# Altium schematic sheet SuperClock_LED.SchDoc
size A4; Organization: Altium Limited; Address1: L3, 12a Rodborough Rd; Address2: Frenchs Forest; Address3: NSW; Address4: Australia 2086
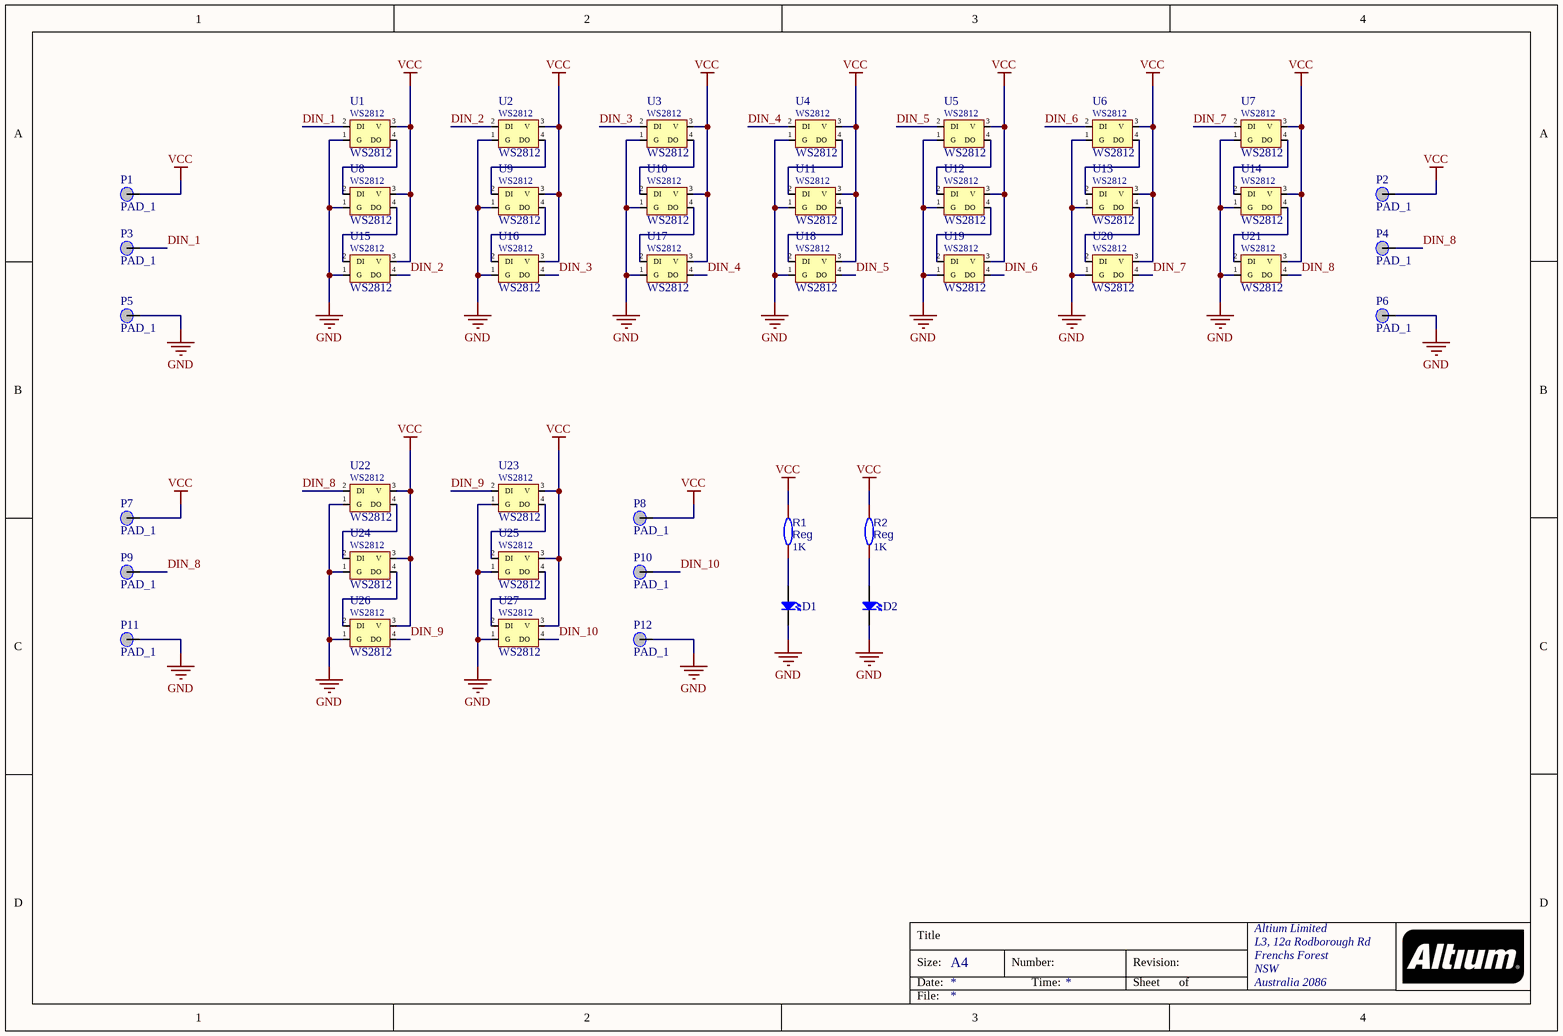
[diagram p0: SuperClock_LED.SchDoc]

## Parts
D1  LED  [LED0603]  (value not drawn)
D2  LED  [LED0603]  (value not drawn)
P1  PAD_1  [PAD_PIN_1_SMD_ARC]
P2  PAD_1  [PAD_PIN_1_SMD_ARC]
P3  PAD_1  [PAD_PIN_1_SMD_ARC]
P4  PAD_1  [PAD_PIN_1_SMD_ARC]
P5  PAD_1  [PAD_PIN_1_SMD_ARC]
P6  PAD_1  [PAD_PIN_1_SMD_ARC]
P7  PAD_1  [PAD_PIN_1_SMD_ARC]
P8  PAD_1  [PAD_PIN_1_SMD_ARC]
P9  PAD_1  [PAD_PIN_1_SMD_ARC]
P10  PAD_1  [PAD_PIN_1_SMD_ARC]
P11  PAD_1  [PAD_PIN_1_SMD_ARC]
P12  PAD_1  [PAD_PIN_1_SMD_ARC]
R1  Reg  value 1K  [R0603]
R2  Reg  value 1K  [R0603]
U1  WS2812  [WS2812B-2020]
U2  WS2812  [WS2812B-2020]
U3  WS2812  [WS2812B-2020]
U4  WS2812  [WS2812B-2020]
U5  WS2812  [WS2812B-2020]
U6  WS2812  [WS2812B-2020]
U7  WS2812  [WS2812B-2020]
U8  WS2812  [WS2812B-2020]
U9  WS2812  [WS2812B-2020]
U10  WS2812  [WS2812B-2020]
U11  WS2812  [WS2812B-2020]
U12  WS2812  [WS2812B-2020]
U13  WS2812  [WS2812B-2020]
U14  WS2812  [WS2812B-2020]
U15  WS2812  [WS2812B-2020]
U16  WS2812  [WS2812B-2020]
U17  WS2812  [WS2812B-2020]
U18  WS2812  [WS2812B-2020]
U19  WS2812  [WS2812B-2020]
U20  WS2812  [WS2812B-2020]
U21  WS2812  [WS2812B-2020]
U22  WS2812  [WS2812B-2020]
U23  WS2812  [WS2812B-2020]
U24  WS2812  [WS2812B-2020]
U25  WS2812  [WS2812B-2020]
U26  WS2812  [WS2812B-2020]
U27  WS2812  [WS2812B-2020]

## Nets
GND: D1.1(K) D2.1(K) P5.1 P6.1 P11.1 P12.1 U1.1(G) U2.1(G) U3.1(G) U4.1(G) U5.1(G) U6.1(G) U7.1(G) U8.1(G) U9.1(G) U10.1(G) U11.1(G) U12.1(G) U13.1(G) U14.1(G) U15.1(G) U16.1(G) U17.1(G) U18.1(G) U19.1(G) U20.1(G) U21.1(G) U22.1(G) U23.1(G) U24.1(G) U25.1(G) U26.1(G) U27.1(G)
VCC: P1.1 P2.1 P7.1 P8.1 R1.2 R2.2 U1.3(V) U2.3(V) U3.3(V) U4.3(V) U5.3(V) U6.3(V) U7.3(V) U8.3(V) U9.3(V) U10.3(V) U11.3(V) U12.3(V) U13.3(V) U14.3(V) U15.3(V) U16.3(V) U17.3(V) U18.3(V) U19.3(V) U20.3(V) U21.3(V) U22.3(V) U23.3(V) U24.3(V) U25.3(V) U26.3(V) U27.3(V)
DIN_1: P3.1 U1.2(DI)
DIN_2: U2.2(DI) U15.4(DO)
DIN_3: U3.2(DI) U16.4(DO)
DIN_4: U4.2(DI) U17.4(DO)
DIN_5: U5.2(DI) U18.4(DO)
DIN_6: U6.2(DI) U19.4(DO)
DIN_7: U7.2(DI) U20.4(DO)
DIN_8: P4.1 P9.1 U21.4(DO) U22.2(DI)
DIN_9: U23.2(DI) U26.4(DO)
DIN_10: P10.1 U27.4(DO)
NetD1_2: D1.2(A) R1.1
NetD2_2: D2.2(A) R2.1
NetU1_4: U1.4(DO) U8.2(DI)
NetU2_4: U2.4(DO) U9.2(DI)
NetU3_4: U3.4(DO) U10.2(DI)
NetU4_4: U4.4(DO) U11.2(DI)
NetU5_4: U5.4(DO) U12.2(DI)
NetU6_4: U6.4(DO) U13.2(DI)
NetU7_4: U7.4(DO) U14.2(DI)
NetU8_4: U8.4(DO) U15.2(DI)
NetU9_4: U9.4(DO) U16.2(DI)
NetU10_4: U10.4(DO) U17.2(DI)
NetU11_4: U11.4(DO) U18.2(DI)
NetU12_4: U12.4(DO) U19.2(DI)
NetU13_4: U13.4(DO) U20.2(DI)
NetU14_4: U14.4(DO) U21.2(DI)
NetU22_4: U22.4(DO) U24.2(DI)
NetU23_4: U23.4(DO) U25.2(DI)
NetU24_4: U24.4(DO) U26.2(DI)
NetU25_4: U25.4(DO) U27.2(DI)

## Notes on the sheet
- Title
- Size:
- Date:
- A4
- Number:
- Time:
- Revision:
- Sheet
- of
- File:

## Library data of the parts
D1 D2 = LED0: Published: 8-Jun-2000; LatestRevisionDate: 08-Jul-2005; LatestRevisionNote: Mech Layer 1 removed.; PackageReference: LED-0; Publisher: Altium Limited; PackageDescription: LED; 2 Leads
P1-P12 = PAD_1: 1脚焊盘
R1 R2 = Res: 电阻; BOM_Manufacturer: Viking Tech; BOM_Manufacturer Part: AR03BTCX1002A; nameAlias: Resistance (Ohms); Contributor: LCSC; BOM_Supplier: LCSC; BOM_Supplier Part: C465721; spicePre: R; spiceSymbolName: AR03BTCX1002A
U1-U27 = WS2812: WS2812全色LED